# EAGLE design v4.mainboard (EAGLE 6.4)
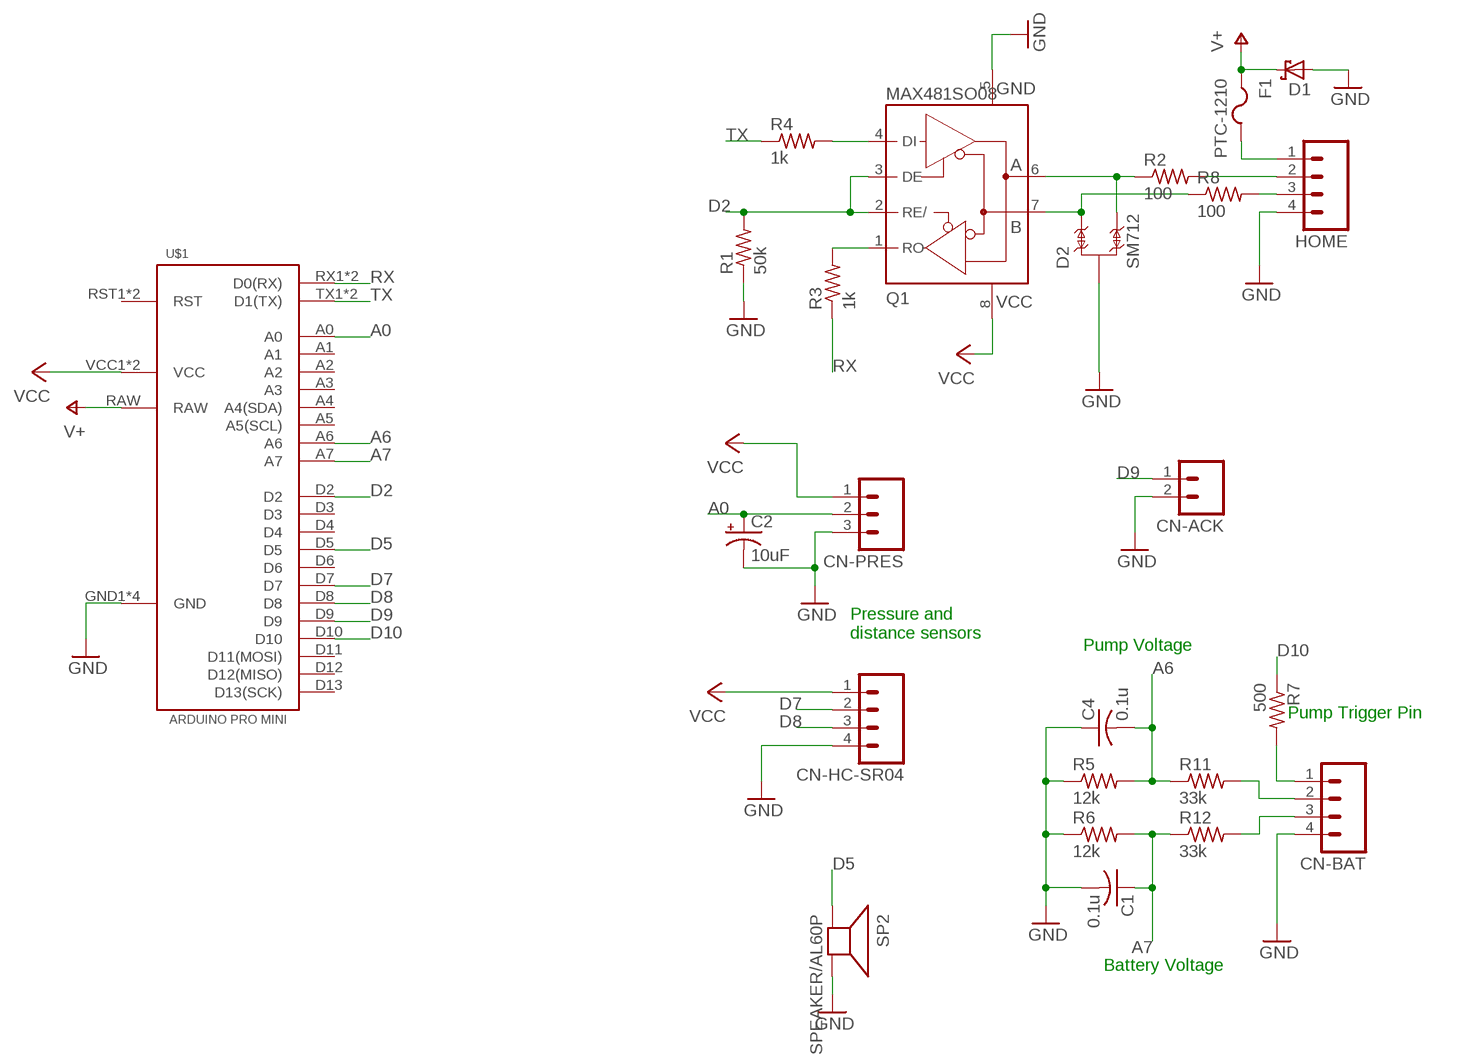
[diagram p0: schematic, sheet 1]

## Parts
C1  0.1u  C-USC0603K  [C0603K]
C2  10uF  CPOL-USE2-5  [E2-5]
C4  0.1u  C-USC0603K  [C0603K]
CN-ACK  M02  [02P]
CN-BAT  M04  [04P]
CN-HC-SR04  M04  [04P]
CN-PRES  M03  [03P]
D1  SCHOTTKY-DIODESMC  [SMC]
D2  SM712  [SOT23-3]
F1  PTC-1210  [1210]
HOME  M04  [04P]
Q1  MAX481SO08  [SO08]
R1  50k  R-US_R0603  [R0603]
R2  100  R-US_R0603  [R0603]
R3  1k  R-US_R0603  [R0603]
R4  1k  R-US_R0603  [R0603]
R5  12k  R-US_R0603  [R0603]
R6  12k  R-US_R0603  [R0603]
R7  500  R-US_R0603  [R0603]
R8  100  R-US_R0603  [R0603]
R11  33k  R-US_R0603  [R0603]
R12  33k  R-US_R0603  [R0603]
SP2  SPEAKER/AL60P  [AL60P]
U$1  ARDUINO-PRO-MINI  [ARDUINO-PRO-MINI]

## Nets
A0: C2.+ CN-PRES.2 U$1.A0
A6: C4.2 R5.2 R11.1 U$1.A6
A7: C1.1 R6.2 R12.1 U$1.A7
D2: Q1.2(RE/) Q1.3(DE) R1.2 U$1.D2
D5: SP2.1(+) U$1.D5
D7: CN-HC-SR04.2 U$1.D7
D8: CN-HC-SR04.3 U$1.D8
D9: CN-ACK.1 U$1.D9
D10: R7.1 U$1.D10
GND: C1.2 C2.- C4.1 CN-ACK.2 CN-BAT.4 CN-HC-SR04.4 CN-PRES.3 D1.A D2.3 HOME.4 Q1.5(GND) R1.1 R5.1 R6.1 SP2.2(-) U$1.GND1(GND) U$1.GND2(GND) U$1.GND3(GND) U$1.GND4(GND)
N$3: F1.2 HOME.1
N$4: D2.2 Q1.7(B) R8.1
N$5: Q1.1(RO) R3.2
N$6: Q1.4(DI) R4.2
N$7: HOME.3 R8.2
N$8: HOME.2 R2.2
N$9: D2.1 Q1.6(A) R2.1
N$10: CN-BAT.2 R11.2
N$11: CN-BAT.3 R12.2
N$16: CN-BAT.1 R7.2
RX: R3.1 U$1.RX1(D0(RX)) U$1.RX2(D0(RX))
TX: R4.1 U$1.TX1(D1(TX)) U$1.TX2(D1(TX))
V+: D1.C F1.1 U$1.RAW
VCC: CN-HC-SR04.1 CN-PRES.1 Q1.8(+5V) U$1.VCC1(VCC) U$1.VCC2(VCC)
Unconnected: U$1.A1 U$1.A2 U$1.A3 U$1.A4(A4(SDA)) U$1.A5(A5(SCL)) U$1.D3 U$1.D4 U$1.D6 U$1.D11(D11(MOSI)) U$1.D12(D12(MISO)) U$1.D13(D13(SCK)) U$1.RST1(RST) U$1.RST2(RST)

## Notes on the sheet
- Pressure and 
  distance sensors
- Pump Voltage
- Pump Trigger Pin
- Battery Voltage

## Library data of the parts
C1 C4 = adafruit:C-US: CAPACITOR, American symbol
C2 = adafruit:CPOL-US: POLARIZED CAPACITOR, American symbol
CN-ACK = con-amp-quick:M02: AMP QUICK CONNECTOR; OC_FARNELL: unknown; OC_NEWARK: unknown
CN-BAT CN-HC-SR04 HOME = con-amp-quick:M04: AMP QUICK CONNECTOR; OC_FARNELL: unknown; OC_NEWARK: unknown
CN-PRES = con-amp-quick:M03: AMP QUICK CONNECTOR; OC_FARNELL: unknown; OC_NEWARK: unknown
D1 = diode:SCHOTTKY-DIODE: Schottky Diode
D2 = serge:SM712: SM712 Series 600W Asymmetrical TVS Diode Array; Datasheet: http://www.littelfuse.com/~/media/electronics/datasheets/tvs_diode_arrays/littelfuse_tvs_diode_array_sm712_datasheet.pdf.pdf
F1 = serge:PTC-1210
Q1 = serge:MAX481
R1-R8 R11 R12 = adafruit:R-US_: RESISTOR, American symbol
SP2 = adafruit:SPEAKER: SPEAKER Source: Buerklin Added PS12 (for part # PS1240 piezo) http://www.ladyada.net/library/pcb/eaglelibrary.html
U$1 = serge:ARDUINO-PRO-MINI

## Board
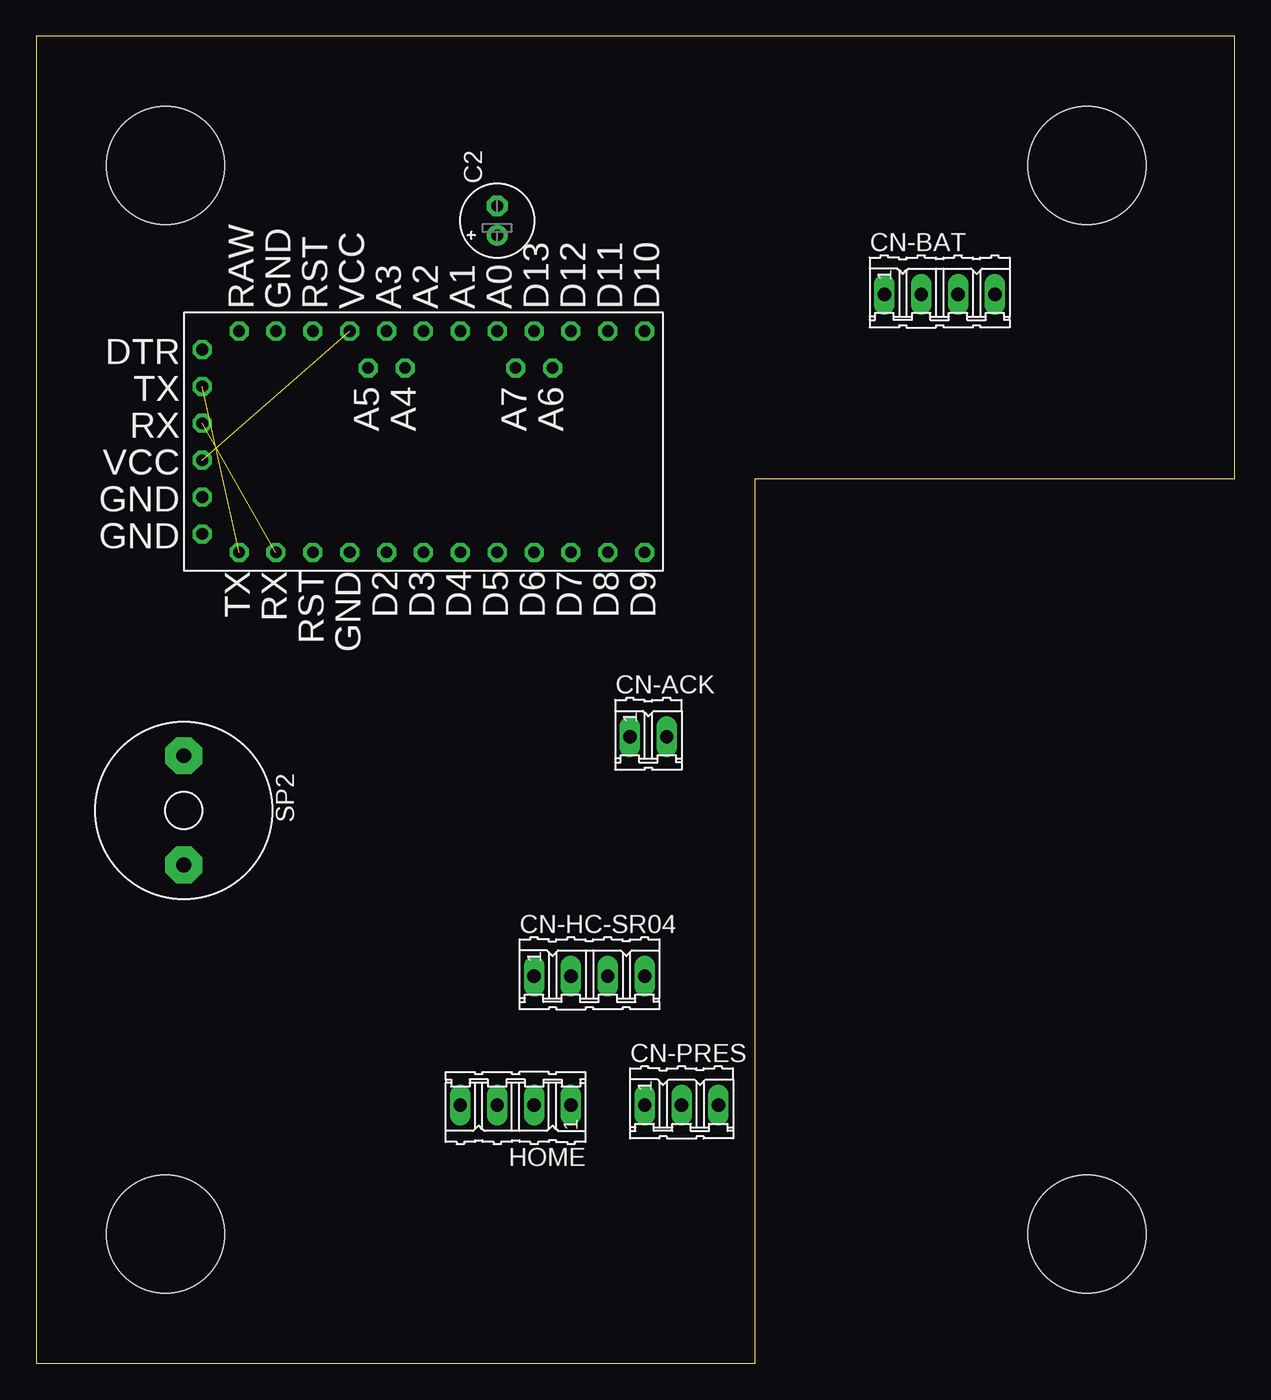
[diagram p1: board, top side]
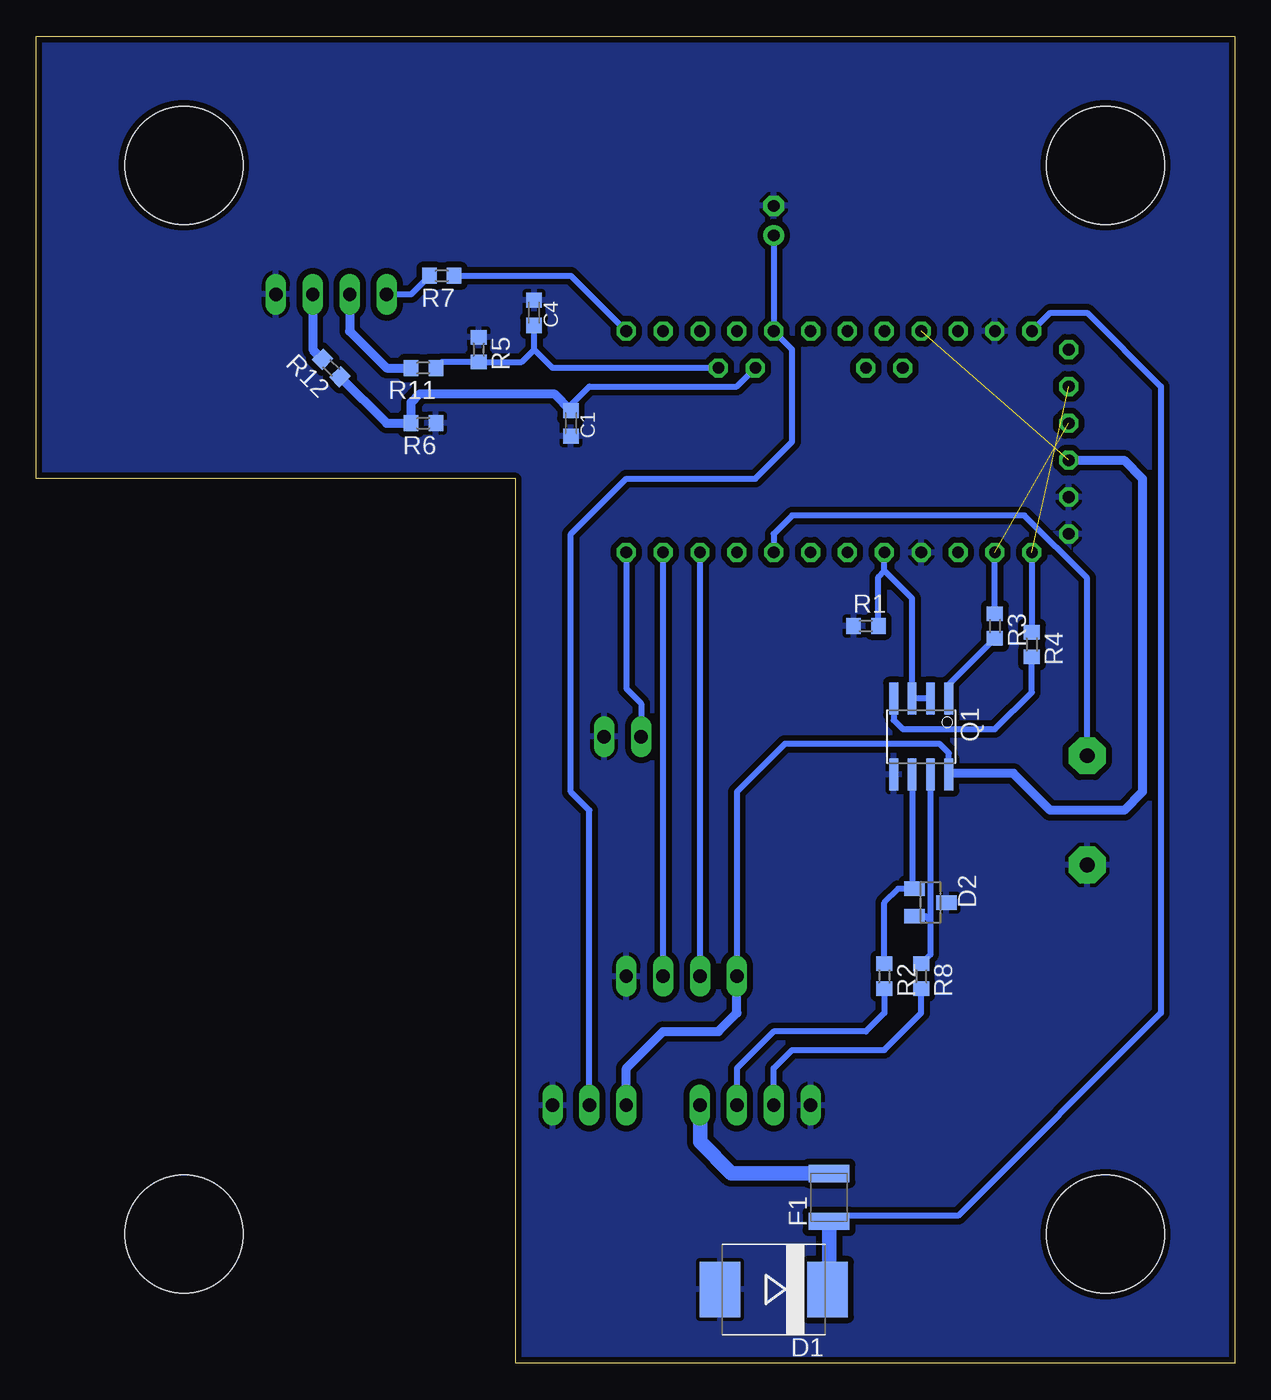
[diagram p2: board, bottom side, seen from below]

Size 82.55 x 91.44 mm. Coordinates in mm from the lower left corner, seen from the top.
Outline: 0,0 49.53,0 49.53,60.96 82.55,60.96 82.55,91.44 0,91.44 0,0
Copper layers (1*16): Top 0.035mm / dielectric 1.5mm / Bottom 0.035mm
Design rules "default": minimum track width 10mil, minimum drill 24mil, track to track 16mil, track to pad 16mil, pad to pad 16mil, via to via 16mil, smd to smd 16mil, copper to edge 16mil, drill to drill 8mil, minimum pad ring 10mil, minimum via ring 8mil, stop-mask expansion 4mil, vias tented up to drill 0mil, thermal gap 10mil
Holes 8.13 mm at 8.89,82.55 72.39,82.55 8.89,8.89 72.39,8.89

### Footprints (pad centres in the part's own frame; a part is rotated, then mirrored left to right if it is on the bottom)
C0603K = smd 1.05 x 1.08: 1 -0.875,0; 2 0.875,0
E2-5 = drill 0.813 pad 1.422: + -1.016,0 | drill 0.813 pad 1.422 octagon: - 1.016,0
02P = drill 0.914 long: 1 -1.27,0; 2 1.27,0
04P = drill 0.914 long: 1 -3.81,0; 2 -1.27,0; 3 1.27,0; 4 3.81,0
03P = drill 0.914 long: 1 -2.54,0; 2 0,0; 3 2.54,0
SMC = smd 2.8 x 3.8: A 3.7,0; C -3.7,0
SOT23-3 = smd 1 x 1.4: 1 -0.95,-1.1; 2 0.95,-1.1; 3 0,1.1
1210 = smd 1.2 x 2.8: 1 -1.65,0; 2 1.65,0
SO08 = smd 0.61 x 2.21: 1 -1.905,-2.616; 2 -0.635,-2.616; 3 0.635,-2.616; 4 1.905,-2.616; 5 1.905,2.616; 6 0.635,2.616; 7 -0.635,2.616; 8 -1.905,2.616
R0603 = smd 1 x 1.1: 1 -0.85,0; 2 0.85,0
AL60P = drill 1.016 pad 2.54 octagon: 1 -3.759,0; 2 3.759,0
ARDUINO-PRO-MINI = drill 0.8 octagon: A0 -3.81,-7.62; A1 -1.27,-7.62; A2 1.27,-7.62; A3 3.81,-7.62; A4 2.54,-5.08; A5 5.08,-5.08; A6 -7.62,-5.08; A7 -5.08,-5.08; D2 3.81,7.62; D3 1.27,7.62; D4 -1.27,7.62; D5 -3.81,7.62; D6 -6.35,7.62; D7 -8.89,7.62; D8 -11.43,7.62; D9 -13.97,7.62; D10 -13.97,-7.62; D11 -11.43,-7.62; D12 -8.89,-7.62; D13 -6.35,-7.62; DTR 16.51,-6.35; GND1 11.43,-7.62; GND2 16.51,6.35; GND3 16.51,3.81; GND4 6.35,7.62; RAW 13.97,-7.62; RST1 8.89,7.62; RST2 8.89,-7.62; RX1 11.43,7.62; RX2 16.51,-1.27; TX1 13.97,7.62; TX2 16.51,-3.81; VCC1 16.51,1.27; VCC2 6.35,-7.62

### Placement (x,y rotation side)
C1  45.72,64.77 270 bottom
C2  31.75,78.74 90 top
C4  48.26,72.39 270 bottom
CN-ACK  42.16,43.18 0 top
CN-BAT  62.23,73.66 0 top
CN-HC-SR04  38.1,26.67 0 top
CN-PRES  44.45,17.78 0 top
D1  31.75,5.08 180 bottom
D2  20.95,31.75 270 bottom
F1  27.94,11.43 90 bottom
HOME  33.02,17.78 180 top
Q1  21.59,43.18 180 bottom
R1  25.4,50.8 0 bottom
R2  24.13,26.67 270 bottom
R3  16.51,50.8 270 bottom
R4  13.97,49.53 270 bottom
R5  52.07,69.85 270 bottom
R6  55.88,64.77 180 bottom
R7  54.61,74.93 180 bottom
R8  21.59,26.67 270 bottom
R11  55.88,68.58 180 bottom
R12  62.23,68.58 135 bottom
SP2  10.16,38.1 270 top
U$1  27.94,63.5 180 top

### Tracks (layer width: path | path; a pad name or v marks a point on that pad's centre or on a via)
A0
  Bottom 0.406: 32,71.37 U$1.A0 | CN-PRES.2 44.45,38.1 45.72,39.37 45.72,57.15 41.91,60.96 33.02,60.96 30.48,63.5 30.48,69.85 U$1.A0 | C2.+ U$1.A0
A6
  Bottom 0.406: U$1.A6 46.99,68.58 48.26,69.85 | 48.26,69.85 C4.2 | R11.1 54.61,69 R5.2 49.11,69 48.26,69.85
A7
  Bottom 0.406: U$1.A7 34.29,67.31 44.45,67.31 45.72,66.04 C1.1
  Bottom 0.61: R12.1 | R12.1 58.42,64.77 R6.2 56.73,66.21 56.13,66.8 46.88,66.8 C1.1
D2
  Bottom 0.406: Q1.2 Q1.3 22.23,52.7 24.13,54.61 | 24.13,54.61 U$1.D2 | R1.2 24.55,54.19 24.13,54.61
D5
  Bottom 0.406: SP2.1 10.16,54.1 14.48,58.42 30.48,58.42 31.75,57.15 U$1.D5
D7
  Bottom 0.406: CN-HC-SR04.2 U$1.D7
D8
  Bottom 0.406: CN-HC-SR04.3 U$1.D8
D9
  Bottom 0.406: U$1.D9 41.91,46.48 40.89,45.47 CN-ACK.1
D10
  Bottom 0.406: R7.1 45.72,74.93 U$1.D10
GND
  pour Bottom: 0,91.44 82.55,91.44 82.55,60.96 49.53,60.96 49.53,0 0,0
N$3
  Bottom 1.016: F1.2 34.67,13.08 36.83,15.24 HOME.1
N$4
  Bottom 0.406: Q1.7 20.95,30.48 | 20.95,30.48 20.95,28.16 R8.1 | D2.2 21.27,30.8 20.95,30.48
N$5
  Bottom 0.406: Q1.1 19.68,46.77 R3.2
N$6
  Bottom 0.406: Q1.4 23.5,44.32 22.86,43.69 16.51,43.69 13.97,46.23 R4.2
N$7
  Bottom 0.406: HOME.3 31.75,20.32 30.48,21.59 24.13,21.59 21.59,24.13 R8.2
N$8
  Bottom 0.406: R2.2 24.13,24.13 25.4,22.86 31.75,22.86 34.29,20.32 HOME.2
N$9
  Bottom 0.406: Q1.6 22.23,32.87 D2.1 23.18,32.7 24.13,31.75 R2.1
N$10
  Bottom 0.61: CN-BAT.2 60.96,71.12 58.42,68.58 R11.2
N$11
  Bottom 0.61: CN-BAT.3 63.5,69.85 R12.2
N$16
  Bottom 0.406: CN-BAT.1 56.73,73.66 R7.2
RX  (1 unrouted)
  Bottom 0.406: R3.1 U$1.RX1
TX  (1 unrouted)
  Bottom 0.406: U$1.TX1 R4.1
V+
  Bottom 0.406: U$1.RAW 12.7,72.39 10.16,72.39 5.08,67.31 5.08,24.13 19.05,10.16 27.56,10.16 F1.1
  Bottom 1.016: F1.1 27.94,5.19 D1.C
VCC  (1 unrouted)
  Bottom 0.406: Q1.8 19.68,42.04 20.32,42.67 30.99,42.67 34.29,39.37 CN-HC-SR04.1
  Bottom 0.61: CN-PRES.1 41.91,20.32 39.37,22.86 35.56,22.86 34.29,24.13 CN-HC-SR04.1 | U$1.VCC1 7.62,62.23 6.35,60.96 6.35,39.37 7.62,38.1 12.7,38.1 15.24,40.64 19.61,40.64 Q1.8